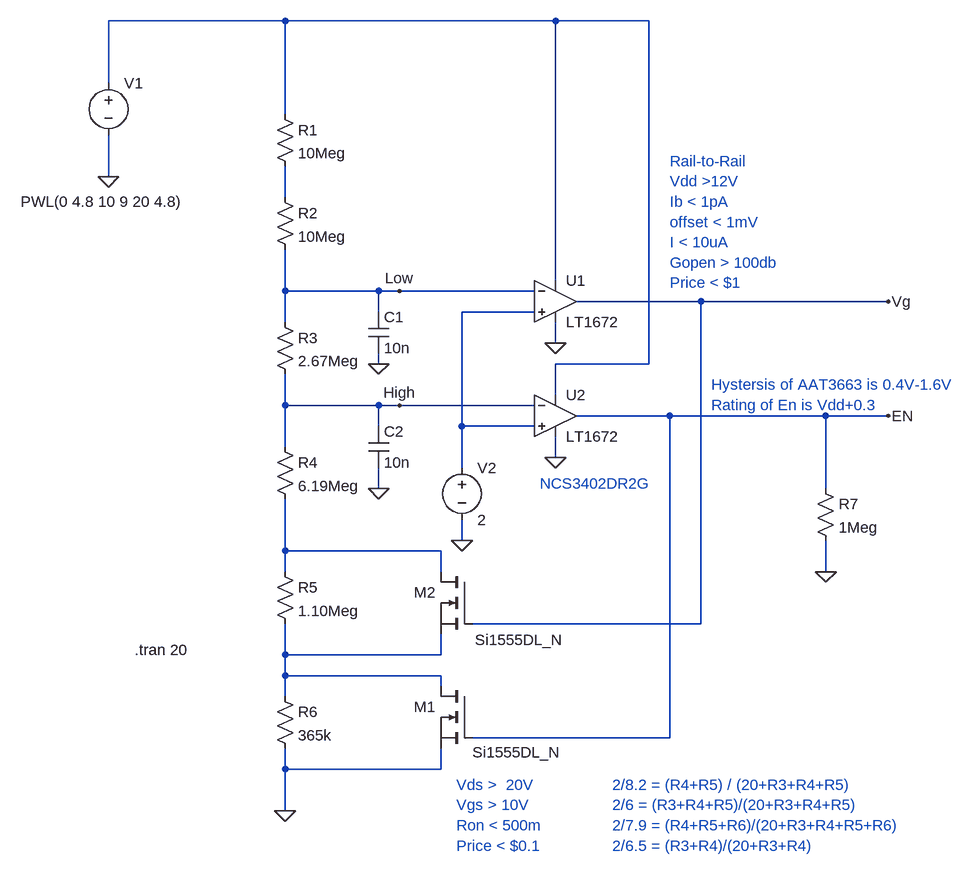
[diagram p0: schematic MarcPlan.asc]
MarcPlan.asc, the LTspice schematic file:
Version 4
SHEET 1 1376 1132
WIRE 304 -144 32 -144
WIRE 720 -144 304 -144
WIRE 864 -144 720 -144
WIRE 32 -48 32 -144
WIRE 304 0 304 -144
WIRE 32 96 32 32
WIRE 304 128 304 80
WIRE 720 256 720 -144
WIRE 304 272 304 208
WIRE 448 272 304 272
WIRE 480 272 448 272
WIRE 688 272 480 272
WIRE 944 288 752 288
WIRE 1232 288 944 288
WIRE 448 304 448 272
WIRE 688 304 576 304
WIRE 304 320 304 272
WIRE 720 352 720 320
WIRE 448 384 448 368
WIRE 864 384 864 -144
WIRE 864 384 720 384
WIRE 720 432 720 384
WIRE 304 448 304 400
WIRE 448 448 304 448
WIRE 480 448 448 448
WIRE 688 448 480 448
WIRE 896 464 752 464
WIRE 1136 464 896 464
WIRE 1232 464 1136 464
WIRE 448 480 448 448
WIRE 576 480 576 304
WIRE 688 480 576 480
WIRE 304 512 304 448
WIRE 720 528 720 496
WIRE 576 544 576 480
WIRE 448 576 448 544
WIRE 1136 576 1136 464
WIRE 576 656 576 624
WIRE 304 672 304 592
WIRE 544 672 304 672
WIRE 304 704 304 672
WIRE 544 704 544 672
WIRE 1136 704 1136 656
WIRE 944 784 944 288
WIRE 944 784 592 784
WIRE 304 832 304 784
WIRE 544 832 544 800
WIRE 544 832 304 832
WIRE 304 864 304 832
WIRE 544 864 304 864
WIRE 544 880 544 864
WIRE 304 896 304 864
WIRE 896 960 896 464
WIRE 896 960 592 960
WIRE 304 1008 304 976
WIRE 544 1008 544 976
WIRE 544 1008 304 1008
WIRE 304 1072 304 1008
FLAG 304 1072 0
FLAG 32 96 0
FLAG 480 272 Low
FLAG 480 448 High
FLAG 576 656 0
FLAG 720 528 0
FLAG 720 352 0
FLAG 1232 464 EN
FLAG 1232 288 Vg
FLAG 448 576 0
FLAG 448 384 0
FLAG 1136 704 0
SYMBOL res 288 -16 R0
SYMATTR InstName R1
SYMATTR Value 10Meg
SYMBOL res 288 112 R0
SYMATTR InstName R2
SYMATTR Value 10Meg
SYMBOL res 288 304 R0
SYMATTR InstName R3
SYMATTR Value 2.67Meg
SYMBOL res 288 496 R0
SYMATTR InstName R4
SYMATTR Value 6.19Meg
SYMBOL res 288 688 R0
SYMATTR InstName R5
SYMATTR Value 1.10Meg
SYMBOL res 288 880 R0
SYMATTR InstName R6
SYMATTR Value 365k
SYMBOL voltage 32 -64 R0
WINDOW 123 0 0 Left 0
WINDOW 39 0 0 Left 0
WINDOW 3 -135 198 Left 2
SYMATTR Value PWL(0 4.8 10 9 20 4.8)
SYMATTR InstName V1
SYMBOL voltage 576 528 R0
WINDOW 123 0 0 Left 0
WINDOW 39 0 0 Left 0
SYMATTR InstName V2
SYMATTR Value 2
SYMBOL nmos 592 880 M0
WINDOW 3 -137 102 Left 2
SYMATTR Value Si1555DL_N
SYMATTR InstName M1
SYMBOL nmos 592 704 M0
WINDOW 3 -141 105 Left 2
SYMATTR Value Si1555DL_N
SYMATTR InstName M2
SYMBOL cap 432 304 R0
SYMATTR InstName C1
SYMATTR Value 10n
SYMBOL cap 432 480 R0
SYMATTR InstName C2
SYMATTR Value 10n
SYMBOL Opamps\\LT1672 720 288 R0
SYMATTR InstName U1
SYMBOL Opamps\\LT1672 720 464 R0
SYMATTR InstName U2
SYMBOL res 1120 560 R0
SYMATTR InstName R7
SYMATTR Value 1Meg
TEXT 72 824 Left 2 !.tran 20
TEXT 808 1032 Left 2 ;2/8.2 = (R4+R5) / (20+R3+R4+R5)\n2/6 = (R3+R4+R5)/(20+R3+R4+R5)\n2/7.9 = (R4+R5+R6)/(20+R3+R4+R5+R6)\n2/6.5 = (R3+R4)/(20+R3+R4)
TEXT 568 1032 Left 2 ;Vds >  20V\nVgs > 10V\nRon < 500m\nPrice < $0.1
TEXT 896 72 Left 2 ;Rail-to-Rail\nVdd >12V\nIb < 1pA\noffset < 1mV\nI < 10uA\nGopen > 100db\nPrice < $1
TEXT 960 416 Left 2 ;Hystersis of AAT3663 is 0.4V-1.6V\nRating of En is Vdd+0.3
TEXT 696 568 Left 2 ;NCS3402DR2G

The netlist it stands for:
* MarcPlan.asc
R1 N001 N002 10Meg
R2 N002 Low 10Meg
R3 Low High 2.67Meg
R4 High N004 6.19Meg
R5 N004 N005 1.10Meg
R6 N005 0 365k
V1 N001 0 PWL(0 4.8 10 9 20 4.8)
V2 N003 0 2
M1 N005 EN 0 0 Si1555DL_N
M2 N004 Vg N005 N005 Si1555DL_N
C1 Low 0 10n
C2 High 0 10n
* U1: LT1672 (symbol Opamps\LT1672 not available, pins judged from their places): In+=N003 In-=Low V+=N001 V-=0 OUT=Vg
* U2: LT1672 (symbol Opamps\LT1672 not available, pins judged from their places): In+=N003 In-=High V+=N001 V-=0 OUT=EN
R7 EN 0 1Meg
.model NMOS NMOS
.model PMOS PMOS
.lib standard.mos
.tran 20
* 2/8.2 = (R4+R5) / (20+R3+R4+R5)
* 2/6 = (R3+R4+R5)/(20+R3+R4+R5)
* 2/7.9 = (R4+R5+R6)/(20+R3+R4+R5+R6)
* 2/6.5 = (R3+R4)/(20+R3+R4)
* Vds >  20V
* Vgs > 10V
* Ron < 500m
* Price < $0.1
* Rail-to-Rail
* Vdd >12V
* Ib < 1pA
* offset < 1mV
* I < 10uA
* Gopen > 100db
* Price < $1
* Hystersis of AAT3663 is 0.4V-1.6V
* Rating of En is Vdd+0.3
* NCS3402DR2G
.backanno
.end